# EAGLE design Teknic_motor_Signal_breakout (EAGLE 9.6.2)
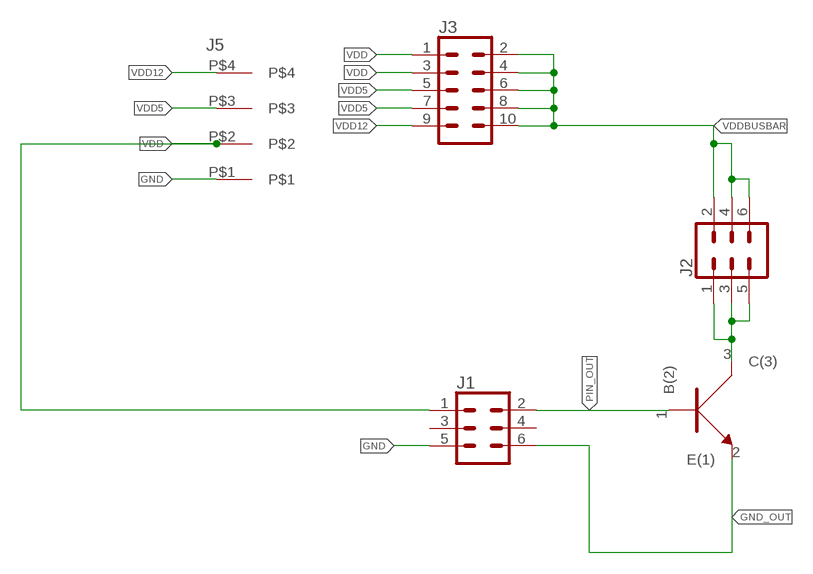
[diagram p0: schematic, sheet 1]

## Parts
J1  CONN_03X2  [2X3]
J2  CONN_03X2  [2X3]
J3  CONN_05X2PTH  [2X5]
J5  4-pos  3.81MM_1_X_4_RT_ANGLE_PLUG_HEADER  [1X4_3.81MM_PITCH]
U1  NPN  BC846BW  [SOT323]

## Nets
GND: J1.5 J5.P$1
GND_OUT: J1.6 U1.2(E(1))
N$3: J2.1 J2.3 J2.5 U1.3(C(3))
PIN_OUT: J1.2 U1.1(B(2))
VDD: J1.1 J3.1 J3.3 J5.P$2
VDD5: J3.5 J3.7 J5.P$3
VDD12: J3.9 J5.P$4
VDDBUSBAR: J2.2 J2.4 J2.6 J3.2 J3.4 J3.6 J3.8 J3.10
Unconnected: J1.3 J1.4

## Library data of the parts
J1 J2 = 3D_MIG_Controller:CONN_03X2: Multi connection point. Often used as Generic Header-pin footprint for 0.1 inch spaced/style header connections For AVR SPI programming port, see special device with nice symbol: "AVR_SPI_PROG_5x2.dev" You can populate with any combo of single row headers, but if you'd like an exact match, check these: 2x5 AVR ICSP Male Header <https://www.sparkfun.com/products/778> (PRT-00778) 2x5 Pin Shrouded Header <https://www.sparkfun.com/products/8506> (PRT-08506) On any of the 0.1 inch spaced packages, you can populate with these: Break Away Headers - Straight <https://www.sparkfun.com/products/116> (PRT-00116) Break Away Male Headers - Right Angle <https://www.sparkfun.com/products/553> (PRT-00553) Female Headers <https://www.sparkfun.com/products/115> (PRT-00115) Break Away Headers - Machine Pin <https://www.sparkfun.com/products/117> (PRT-00117) Break Away Female Headers - Swiss Machine Pin <https://www.sparkfun.com/products/743> (PRT-00743) Special note: the shrouded connector mates well with our 5x2 ribbon cables: 2x5 Pin IDC Ribbon Cable <https://www.sparkfun.com/products/8535> (PRT-08535)
J3 = 3D_MIG_Controller:CONN_05X2: Multi connection point. Often used as Generic Header-pin footprint for 0.1 inch spaced/style header connections For AVR SPI programming port, see special device with nice symbol: "AVR_SPI_PROG_5x2.dev" You can populate with any combo of single row headers, but if you'd like an exact match, check these: 2x5 AVR ICSP Male Header <https://www.sparkfun.com/products/778> (PRT-00778) 2x5 Pin Shrouded Header <https://www.sparkfun.com/products/8506> (PRT-08506) On any of the 0.1 inch spaced packages, you can populate with these: Break Away Headers - Straight <https://www.sparkfun.com/products/116> (PRT-00116) Break Away Male Headers - Right Angle <https://www.sparkfun.com/products/553> (PRT-00553) Female Headers <https://www.sparkfun.com/products/115> (PRT-00115) Break Away Headers - Machine Pin <https://www.sparkfun.com/products/117> (PRT-00117) Break Away Female Headers - Swiss Machine Pin <https://www.sparkfun.com/products/743> (PRT-00743) Special note: the shrouded connector mates well with our 5x2 ribbon cables: 2x5 Pin IDC Ribbon Cable <https://www.sparkfun.com/products/8535> (PRT-08535); PROD_ID: CONN-08499; SF_ID: PRT-0778
J5 = 3D_MIG_Controller:3.81MM_1_X_4_RT_ANGLE_PLUG_HEADER: 4 Position Terminal Block Header, Male Pins, Shrouded (4 Side) 0.150" (3.81mm) 90°, Right Angle - Through Hole; PARTNO: 691322310004
U1 = 3D_MIG_Controller:BC846BW: Bipolar (BJT) Transistor NPN 100MHz Surface Mount SOT-323; PARTNO: BC846BW_NPN

## Board
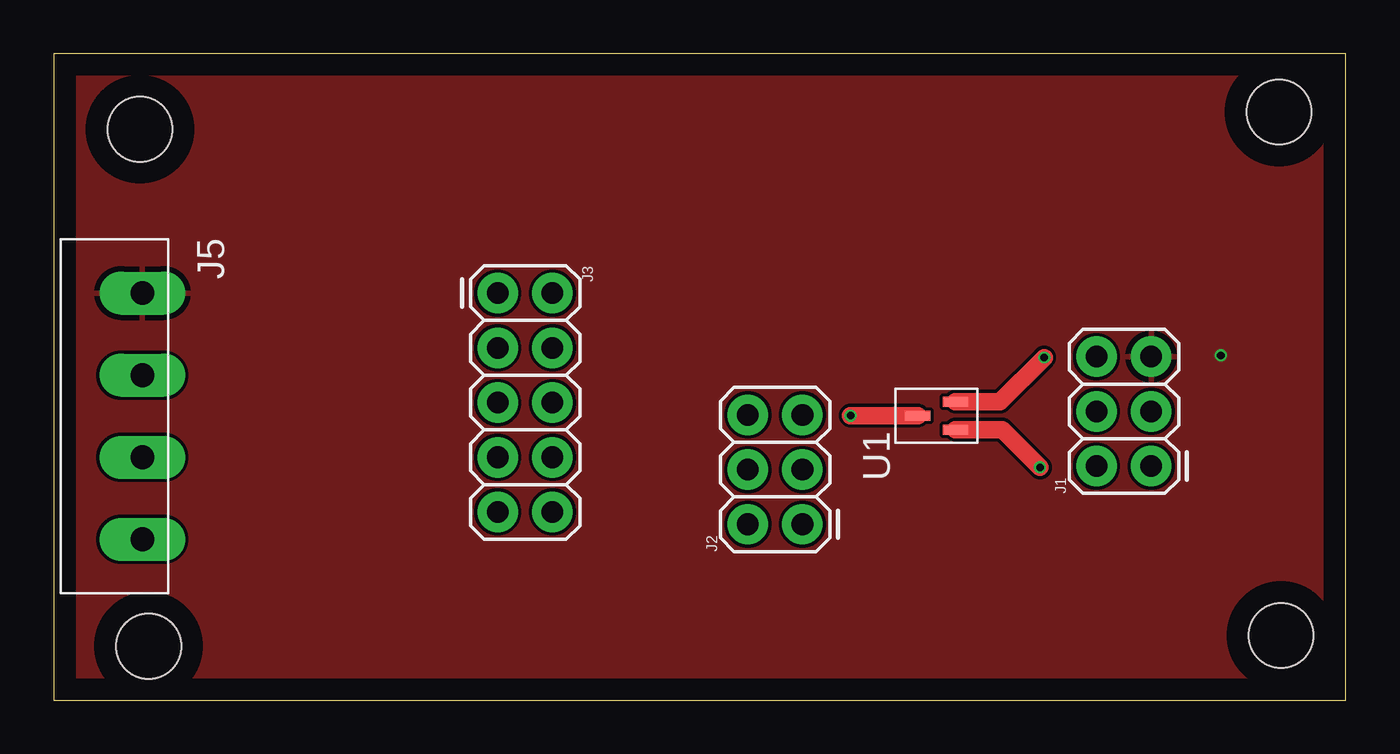
[diagram p1: board, top side]
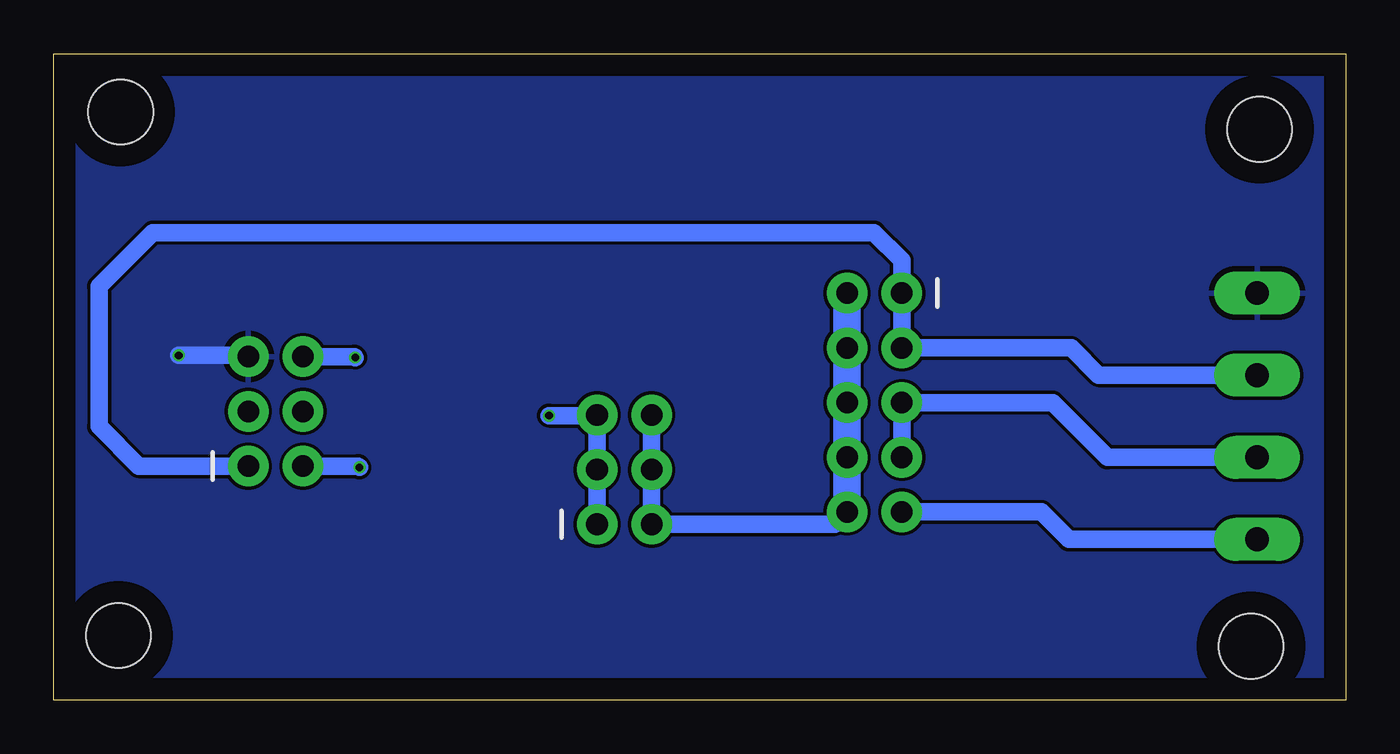
[diagram p2: board, bottom side, seen from below]

Size 60 x 30 mm. Coordinates in mm from the lower left corner, seen from the top.
Outline: 0,0 60,0 60,30 0,30 0,0
Copper layers (1*16): Top 0.035mm / dielectric 1.5mm / Bottom 0.035mm
Design rules "default": minimum track width 6mil, minimum drill 0.2mm, track to track 6mil, track to pad 6mil, pad to pad 6mil, via to via 6mil, smd to smd 6mil, copper to edge 40mil, drill to drill 6mil, minimum pad ring 10mil, minimum via ring 4mil, stop-mask expansion 4mil, vias tented up to drill 0mil, thermal gap 10mil
Holes 3 mm at 4,26.5 4.4,2.5 57,3 56.9,27.3

### Footprints (pad centres in the part's own frame; a part is rotated, then mirrored left to right if it is on the bottom)
2X3 = drill 1 pad 1.88: 1 -2.54,-1.27; 2 -2.54,1.27; 3 0,-1.27; 4 0,1.27; 5 2.54,-1.27; 6 2.54,1.27
2X5 = drill 1 pad 1.88: 1 0,0; 2 0,2.54; 3 2.54,0; 4 2.54,2.54; 5 5.08,0; 6 5.08,2.54; 7 7.62,0; 8 7.62,2.54; 9 10.16,0; 10 10.16,2.54
1X4_3.81MM_PITCH = drill 1.1 pad 2 long: P$1 0,0; P$2 3.81,0; P$3 7.62,0; P$4 11.43,0
SOT323 = smd 0.457 x 1.168: 1 -0.65,-0.876; 2 0.65,-0.876; 3 0,0.876

### Placement (x,y rotation side)
J1  49.7,13.4 90 top
J2  33.5,10.7 90 top
J3  20.62,18.89 270 top
J5  4.11,18.89 270 top
U1  41,13.2 90 top

### Tracks (layer width: path | path; a pad name or v marks a point on that pad's centre or on a via)
GND  (via drill 0.35)
  Bottom 0.813: J1.5 51.03,16 v54.2,16
  pour Bottom: -1,31 61.6,31 61.6,-4.9 -1,-4.9
  pour Top: -1,31 61.6,31 61.6,-1.7 -1,-1.7
GND_OUT  (via drill 0.35)
  Top 0.813: v46,15.9 43.95,13.85 U1.2
  Bottom 0.813: J1.6 46.04,15.94 v46,15.9
N$3  (via drill 0.35)
  Top 0.813: U1.3 v37,13.2
  Bottom 0.813: v37,13.2 34.81,13.2 | 34.81,13.2 J2.5 | J2.1 J2.3 34.77,13.16 34.81,13.2
PIN_OUT  (via drill 0.35)
  Top 0.813: v45.8,10.8 44.05,12.55 U1.1
  Bottom 0.813: J1.2 45.86,10.86 v45.8,10.8
VDD
  Bottom 0.813: J5.P$2 11.48,15.08 12.75,16.35 J3.3 J3.1 20.62,20.42 21.9,21.7 55.4,21.7 57.9,19.2 57.9,12.7 56.06,10.86 J1.1
VDD5
  Bottom 0.813: J5.P$3 11.07,11.27 13.61,13.81 J3.5 J3.7
VDD12
  Bottom 0.813: J3.9 14.13,8.73 12.86,7.46 J5.P$4
VDDBUSBAR
  Bottom 0.813: J2.6 J2.4 J2.2 23.73,8.16 J3.10
  Bottom 1.27: J3.10 J3.8 J3.6 J3.4 J3.2